# EAGLE design Ararinha4 (EAGLE 7.1.0)
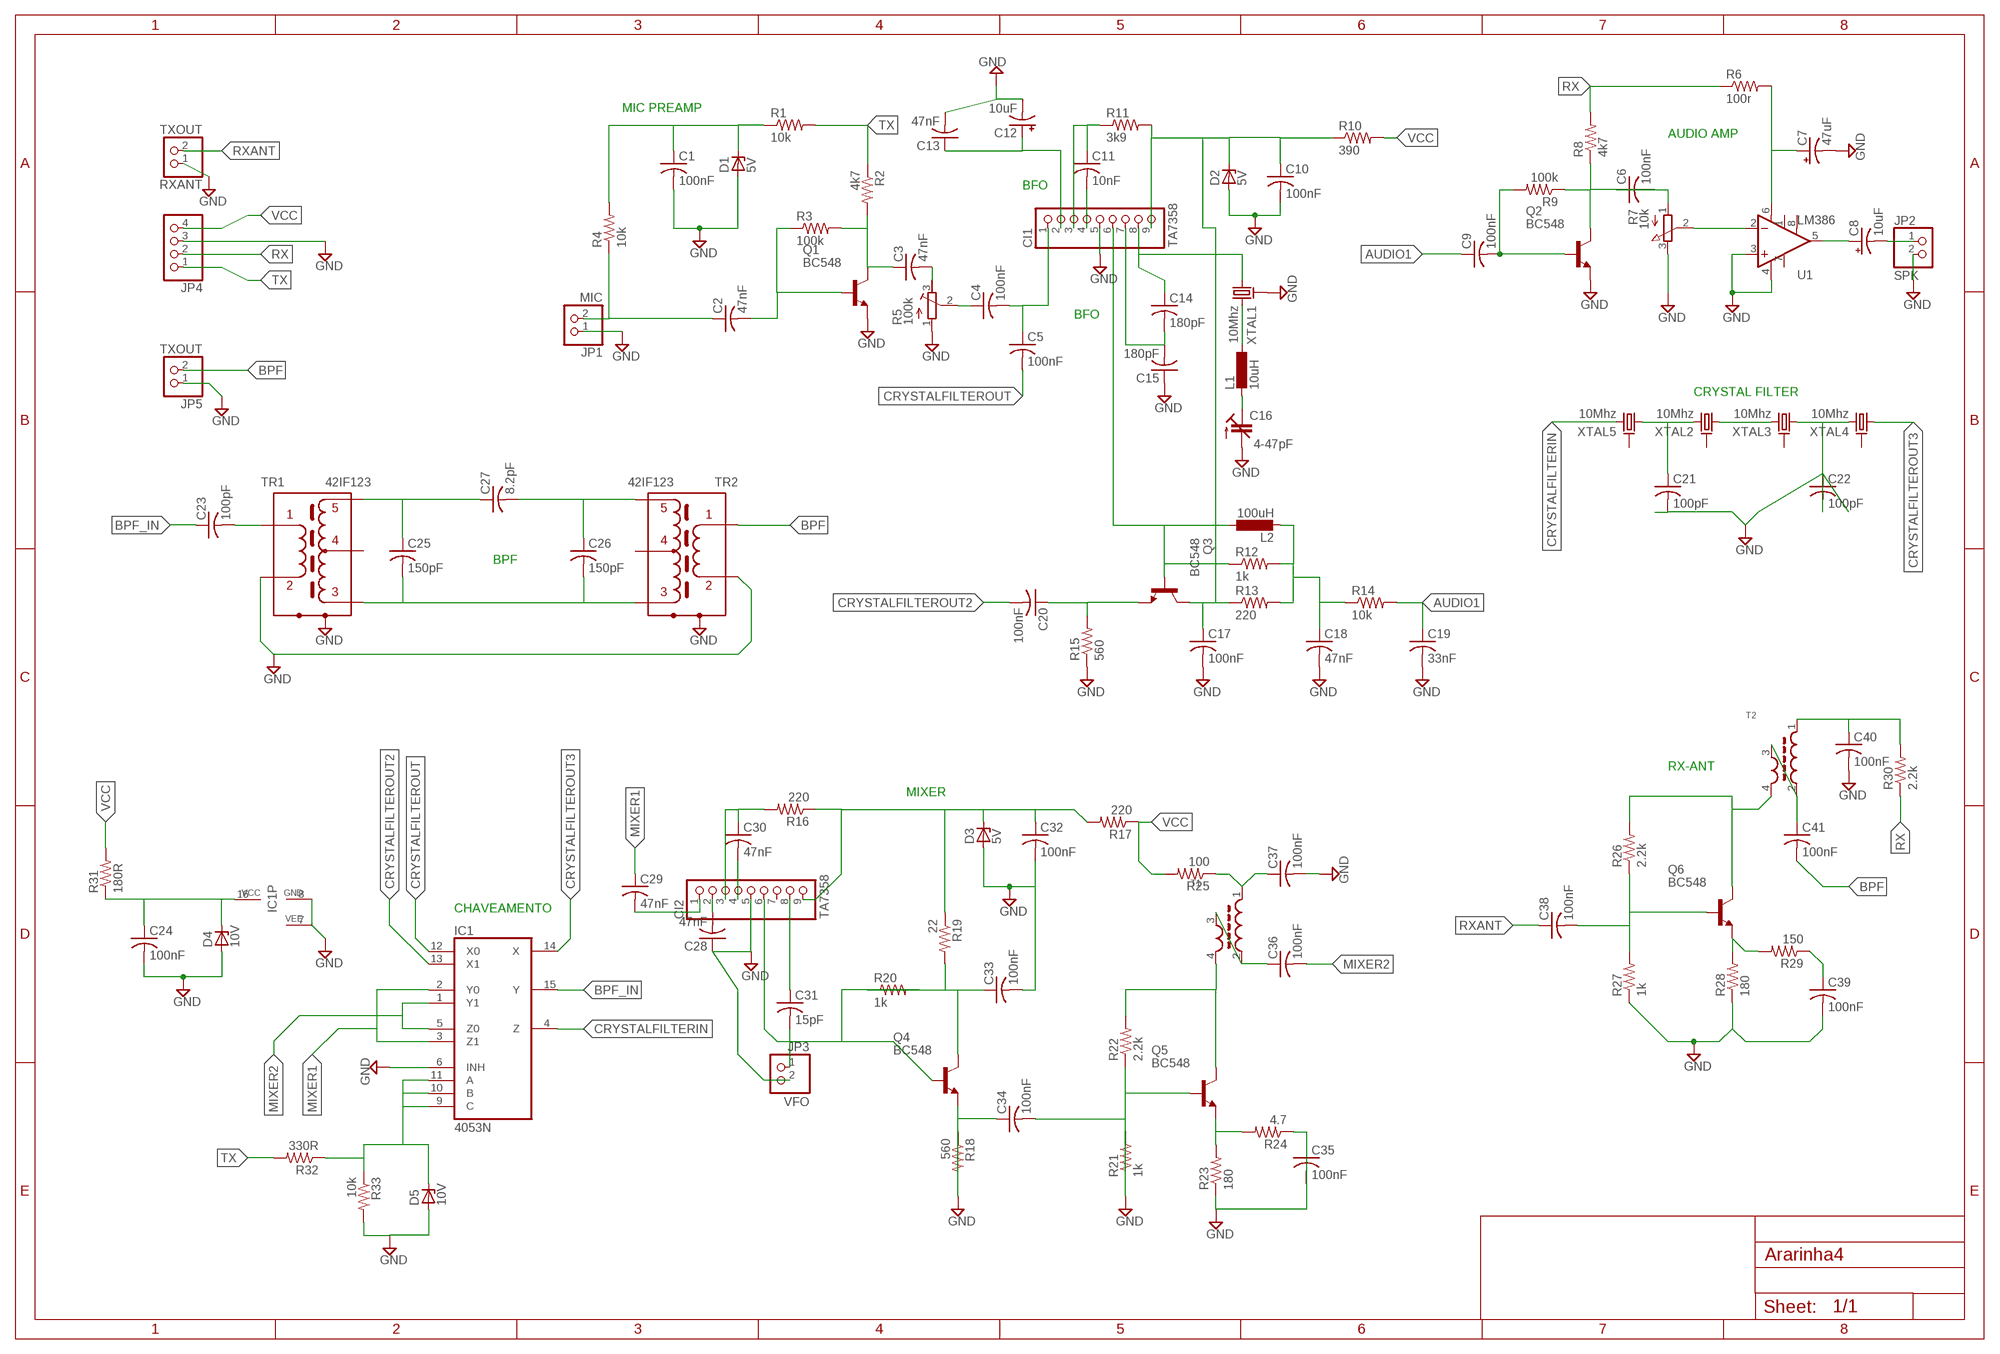
[diagram p0: schematic, sheet 1]

## Parts
C1  100nF  C-US050-030X075  [C050-030X075]
C2  47nF  C-US050-030X075  [C050-030X075]
C3  47nF  C-US050-030X075  [C050-030X075]
C4  100nF  C-US050-030X075  [C050-030X075]
C5  100nF  C-US050-030X075  [C050-030X075]
C6  100nF  C-US050-030X075  [C050-030X075]
C7  47uF  CPOL-USE5-6  [E5-6]
C8  10uF  CPOL-USE5-6  [E5-6]
C9  100nF  C-US050-030X075  [C050-030X075]
C10  100nF  C-US050-030X075  [C050-030X075]
C11  10nF  C-US050-030X075  [C050-030X075]
C12  10uF  CPOL-USE5-6  [E5-6]
C13  47nF  C-US050-030X075  [C050-030X075]
C14  180pF  C-US050-030X075  [C050-030X075]
C15  180pF  C-US050-030X075  [C050-030X075]
C16  4-47pF  C-TRIMM3050.504  [CTRIM3050.504]
C17  100nF  C-US050-030X075  [C050-030X075]
C18  47nF  C-US050-030X075  [C050-030X075]
C19  33nF  C-US050-030X075  [C050-030X075]
C20  100nF  C-US050-030X075  [C050-030X075]
C21  100pF  C-US050-030X075  [C050-030X075]
C22  100pF  C-US050-030X075  [C050-030X075]
C23  100pF  C-US050-030X075  [C050-030X075]
C24  100nF  C-US050-030X075  [C050-030X075]
C25  150pF  C-US050-030X075  [C050-030X075]
C26  150pF  C-US050-030X075  [C050-030X075]
C27  8.2pF  C-US050-030X075  [C050-030X075]
C28  47nF  C-US050-030X075  [C050-030X075]
C29  47nF  C-US050-030X075  [C050-030X075]
C30  47nF  C-US050-030X075  [C050-030X075]
C31  15pF  C-US050-030X075  [C050-030X075]
C32  100nF  C-US050-030X075  [C050-030X075]
C33  100nF  C-US050-030X075  [C050-030X075]
C34  100nF  C-US050-030X075  [C050-030X075]
C35  100nF  C-US050-030X075  [C050-030X075]
C36  100nF  C-US050-030X075  [C050-030X075]
C37  100nF  C-US050-030X075  [C050-030X075]
C38  100nF  C-US050-030X075  [C050-030X075]
C39  100nF  C-US050-030X075  [C050-030X075]
C40  100nF  C-US050-030X075  [C050-030X075]
C41  100nF  C-US050-030X075  [C050-030X075]
CI1  TA7358  PINHD-1X9  [1X09]
CI2  TA7358  PINHD-1X9  [1X09]
D1  5V  ZENER-DIODEZD-5  [ZDIO-5]
D2  5V  ZENER-DIODEZD-5  [ZDIO-5]
D3  5V  ZENER-DIODEZD-5  [ZDIO-5]
D4  10V  ZENER-DIODEZD-5  [ZDIO-5]
D5  10V  ZENER-DIODEZD-5  [ZDIO-5]
IC1  4053N  [DIL16]
JP1  MIC  PINHD-1X2  [1X02]
JP2  SPK  PINHD-1X2  [1X02]
JP3  VFO  PINHD-1X2  [1X02]
JP4  PINHD-1X4  [1X04]
JP5  TXOUT  PINHD-1X2  [1X02]
L1  10uH  L-EU0207/7  [0207/7]
L2  100uH  L-EU0207/7  [0207/7]
Q1  BC548  [TO92-EBC]
Q2  BC548  [TO92-EBC]
Q3  BC548  [TO92-EBC]
Q4  BC548  [TO92-EBC]
Q5  BC548  [TO92-EBC]
Q6  BC548  [TO92-EBC]
R1  10k  R-US_0204/7  [0204/7]
R2  4k7  R-US_0204/7  [0204/7]
R3  100k  R-US_0204/7  [0204/7]
R4  10k  R-US_0204/7  [0204/7]
R5  100k  R-TRIMM3299W  [RTRIM3299W]
R6  100r  R-US_0204/7  [0204/7]
R7  10k  3RP/1610N  [3RP/1610N]
R8  4k7  R-US_0204/7  [0204/7]
R9  100k  R-US_0204/7  [0204/7]
R10  390  R-US_0204/7  [0204/7]
R11  3k9  R-US_0204/7  [0204/7]
R12  1k  R-US_0204/7  [0204/7]
R13  220  R-US_0204/7  [0204/7]
R14  10k  R-US_0204/7  [0204/7]
R15  560  R-US_0204/7  [0204/7]
R16  220  R-US_0204/7  [0204/7]
R17  220  R-US_0204/7  [0204/7]
R18  560  R-US_0204/7  [0204/7]
R19  22  R-US_0204/7  [0204/7]
R20  1k  R-US_0204/7  [0204/7]
R21  1k  R-US_0204/7  [0204/7]
R22  2.2k  R-US_0204/7  [0204/7]
R23  180  R-US_0204/7  [0204/7]
R24  4.7  R-US_0204/7  [0204/7]
R25  100  R-US_0204/7  [0204/7]
R26  2.2k  R-US_0204/7  [0204/7]
R27  1k  R-US_0204/7  [0204/7]
R28  180  R-US_0204/7  [0204/7]
R29  150  R-US_0204/7  [0204/7]
R30  2.2k  R-US_0204/7  [0204/7]
R31  180R  R-US_0204/7  [0204/7]
R32  330R  R-US_0204/7  [0204/7]
R33  10k  R-US_0204/7  [0204/7]
RXANT  TXOUT  PINHD-1X2  [1X02]
T1  TOROID-T37-4PIN  [TOROID-T37-4PIN]
T2  TOROID-T37-4PIN  [TOROID-T37-4PIN]
TR1  42IF123  [42IF123]
TR2  42IF123  [42IF123]
U1  LM386  [DIP08]
XTAL1  10Mhz  CRISTAL_EM_PÉ  [CRISTAL_EM_PÉ]
XTAL2  10Mhz  CRISTAL_EM_PÉ  [CRISTAL_EM_PÉ]
XTAL3  10Mhz  CRISTAL_EM_PÉ  [CRISTAL_EM_PÉ]
XTAL4  10Mhz  CRISTAL_EM_PÉ  [CRISTAL_EM_PÉ]
XTAL5  10Mhz  CRISTAL_EM_PÉ  [CRISTAL_EM_PÉ]

## Nets
AUDIO1: C9.1 C19.1 R14.2
BPF: C41.2 JP5.2 TR2.P$1
BPF_IN: C23.1 IC1.15(Y)
CRYSTALFILTERIN: IC1.4(Z) XTAL5.1
CRYSTALFILTEROUT: C5.2 IC1.12(X0)
CRYSTALFILTEROUT2: C20.2 IC1.13(X1)
CRYSTALFILTEROUT3: IC1.14(X) XTAL4.2
GND: C1.2 C7.- C10.2 C12.- C13.2 C15.1 C16.2(A) C17.2 C18.2 C19.2 C21.2 C22.1 C24.2 C28.1 C32.2 C33.2 C35.1 C37.2 C39.2 C40.2 CI1.5 CI2.5 D1.A D2.A D3.A D4.A D5.A IC1.6(INH) IC1.7(VEE) IC1.8(GND) JP1.1 JP2.2 JP3.2 JP4.3 JP5.1 Q1.E Q2.E R5.1(E) R7.3(E) R15.1 R18.1 R21.2 R23.1 R27.1 R28.1 R33.2 RXANT.1 TR1.P$2 TR1.P$7 TR2.P$2 TR2.P$6 U1.3(+IN) U1.4(V-) XTAL1.GND
MIXER1: C29.1 IC1.2(Y0) IC1.3(Z1)
MIXER2: C36.2 IC1.1(Y1) IC1.5(Z0)
N$1: C1.1 D1.C R1.1 R4.2
N$2: C3.2 R5.3(A)
N$3: C4.1 R5.2(S)
N$4: C4.2 C5.1 CI1.1
N$5: C3.1 Q1.C R2.2 R3.2
N$6: C2.2 Q1.B R3.1
N$7: C2.1 JP1.2 R4.1
N$8: C9.2 Q2.B R9.2
N$9: C7.+ R6.2 U1.6(V+)
N$10: C6.1 R7.1(A)
N$11: C8.+ U1.5(OUT)
N$12: C8.- JP2.1
N$13: R7.2(S) U1.2(-IN)
N$14: C6.2 Q2.C R8.1 R9.1
N$15: C20.1 Q3.E R15.2
N$16: C11.2 CI1.4
N$17: C11.1 CI1.3 R11.1
N$18: L1.1 XTAL1.1
N$19: C12.+ C13.1 CI1.2
N$20: C16.1(E) L1.2
N$21: C14.2 C15.2 CI1.7
N$22: C14.1 CI1.8 XTAL1.2
N$23: CI1.6 L2.1 Q3.B R12.1
N$24: C10.1 C17.1 CI1.9 D2.C Q3.C R10.1 R11.2 R13.1
N$25: C21.1 XTAL2.1 XTAL5.2
N$26: C18.1 L2.2 R12.2 R13.2 R14.1
N$27: XTAL2.2 XTAL3.1
N$28: C22.2 XTAL3.2 XTAL4.1
N$29: C25.2 C26.2 TR1.P$3 TR2.P$3
N$30: C28.2 CI2.2
N$31: C23.2 TR1.P$1
N$32: D5.C IC1.9(C) IC1.10(B) IC1.11(A) R32.1 R33.1
N$33: C26.1 C27.2 TR2.P$5
N$34: C25.1 C27.1 TR1.P$5
N$35: C29.2 CI2.1
N$36: C30.2 CI2.4
N$37: C30.1 CI2.3 R16.2
N$38: C32.1 CI2.9 D3.C R16.1 R17.2 R19.1
N$39: C31.1 CI2.8
N$40: C31.2 JP3.1
N$41: C34.1 Q4.E R18.2
N$42: CI2.6 Q4.B R20.2
N$43: C35.2 R24.1
N$44: C33.1 Q4.C R19.2 R20.1
N$45: C36.1 T1.2 T1.3
N$46: C34.2 Q5.B R21.1 R22.1
N$47: Q5.C R22.2 T1.4
N$48: Q5.E R23.2 R24.2
N$49: C37.1 R25.1 T1.1
N$50: C38.2 Q6.B R26.1 R27.2
N$51: Q6.E R28.2 R29.2
N$52: C39.1 R29.1
N$53: C24.1 D4.C IC1.16(VCC) R31.1
N$54: Q6.C R26.2 T2.4
N$55: C41.1 T2.2 T2.3
N$56: C40.1 R30.2 T2.1
RX: JP4.2 R6.1 R8.2 R30.1
RXANT: C38.1 RXANT.2
TX: JP4.1 R1.2 R2.1 R32.2
VCC: JP4.4 R10.2 R17.1 R25.2 R31.2
Unconnected: CI2.7 TR1.P$4 TR1.P$6 TR2.P$4 TR2.P$7 U1.1(GAIN) U1.7(BP) U1.8(GAIN) XTAL2.GND XTAL3.GND XTAL4.GND XTAL5.GND

## Notes on the sheet
- MIC PREAMP
- AUDIO AMP
- BFO
- BFO
- CRYSTAL FILTER
- BPF
- RX-ANT
- MIXER
- CHAVEAMENTO

## Library data of the parts
C1-C6 C9-C11 C13-C15 C17-C41 = resistor:C-US: CAPACITOR, American symbol
C7 C8 C12 = resistor:CPOL-US: POLARIZED CAPACITOR, American symbol
C16 = resistor:C-TRIMM: Trimm capacitor
CI1 CI2 = pinhead:PINHD-1X9: PIN HEADER
D1-D5 = diode:ZENER-DIODE: Z-Diode
IC1 = 40xx:4053: Triple 2-channel ANALOG MULTIPLEXER
JP1-JP3 JP5 RXANT = pinhead:PINHD-1X2: PIN HEADER
JP4 = pinhead:PINHD-1X4: PIN HEADER
L1 L2 = resistor:L-EU: INDUCTOR, European symbol
Q1-Q6 = transistor-npn:BC548*: NPN Transistor
R1-R4 R6 R8-R33 = resistor:R-US_: RESISTOR, American symbol
R5 = resistor:R-TRIMM: Trimm resistor
R7 = pot:3RP/1610N: 16mm Potentiometer one level Source: http://www.alphapotentiometers.net/html/16mm_pot_2.html
T1 T2 = Toroid_T37:TOROID-T37-4PIN: Toroidal trafo of size T37 (9.53 x 5.21 x 3.25). Outward shape corresponds to one layer winding with wire of diameter 0.4mm.
TR1 TR2 = 42IF123:42IF123: IF transformer 10.7 MHz
U1 = Sparkfun-Eagle-Libraries:LM386: low voltage audio power amplifier
XTAL1-XTAL5 = Controle_de_pedais:CRISTAL_EM_PÉ

## Board
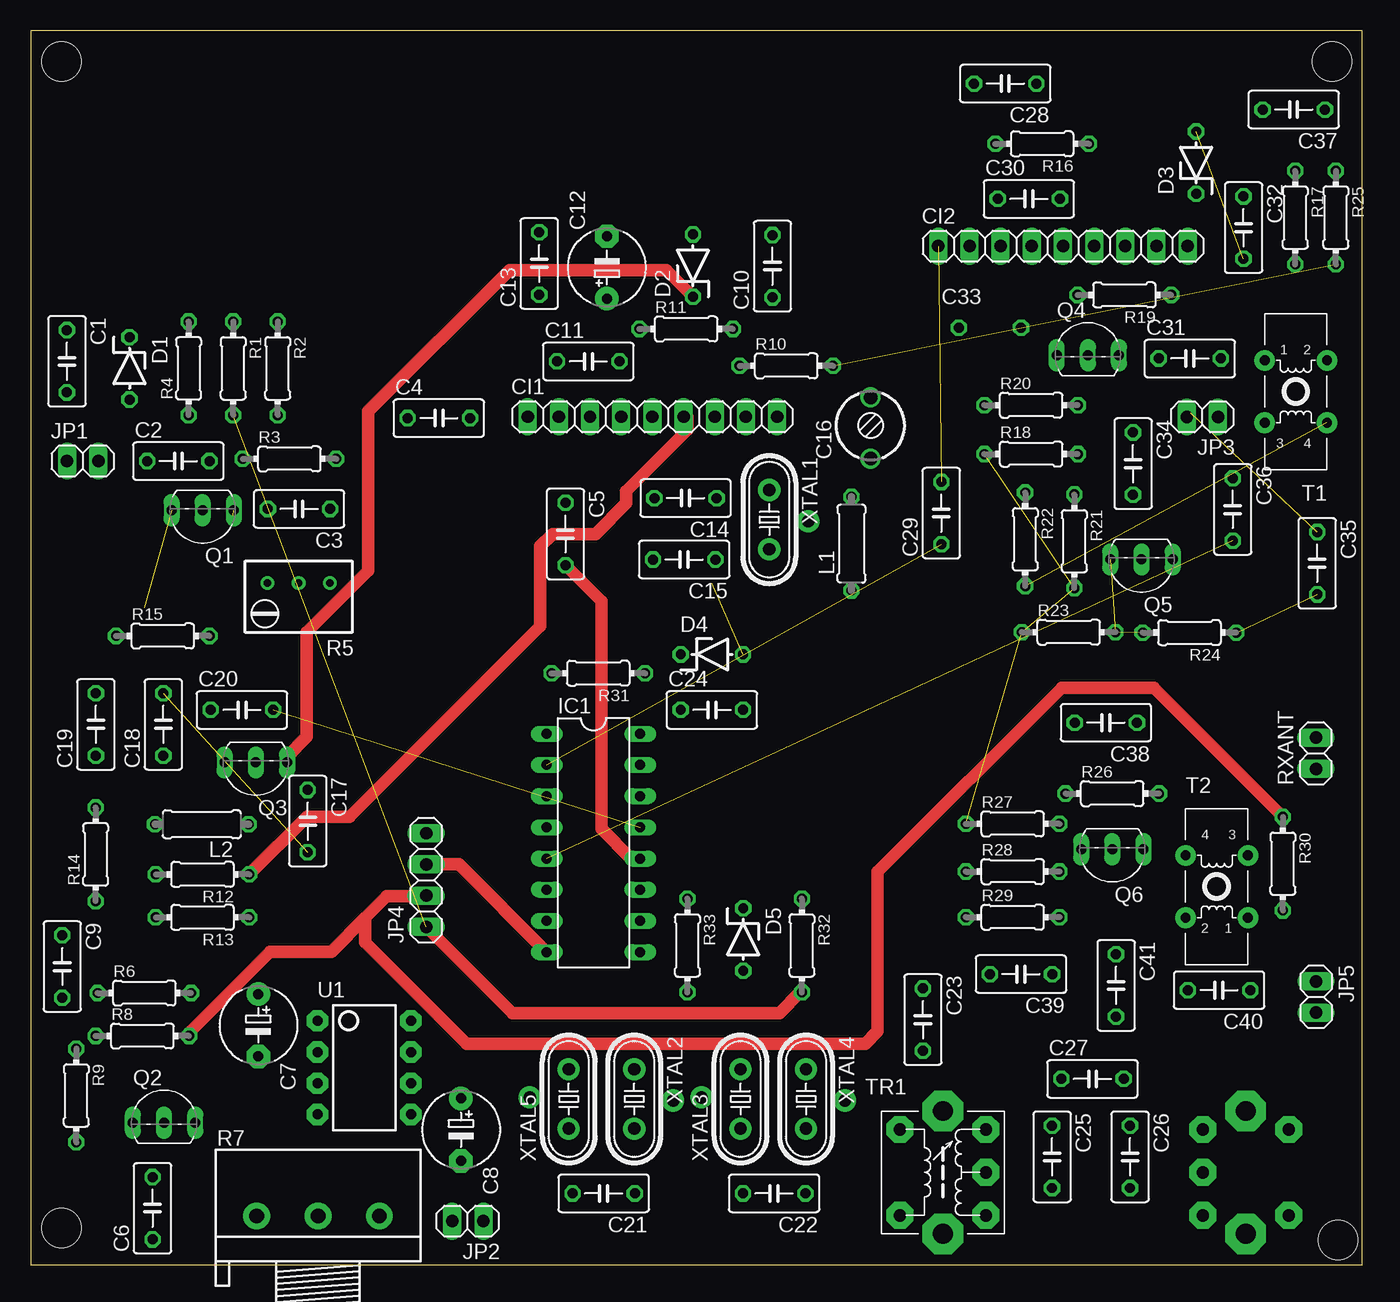
[diagram p1: board, top side]
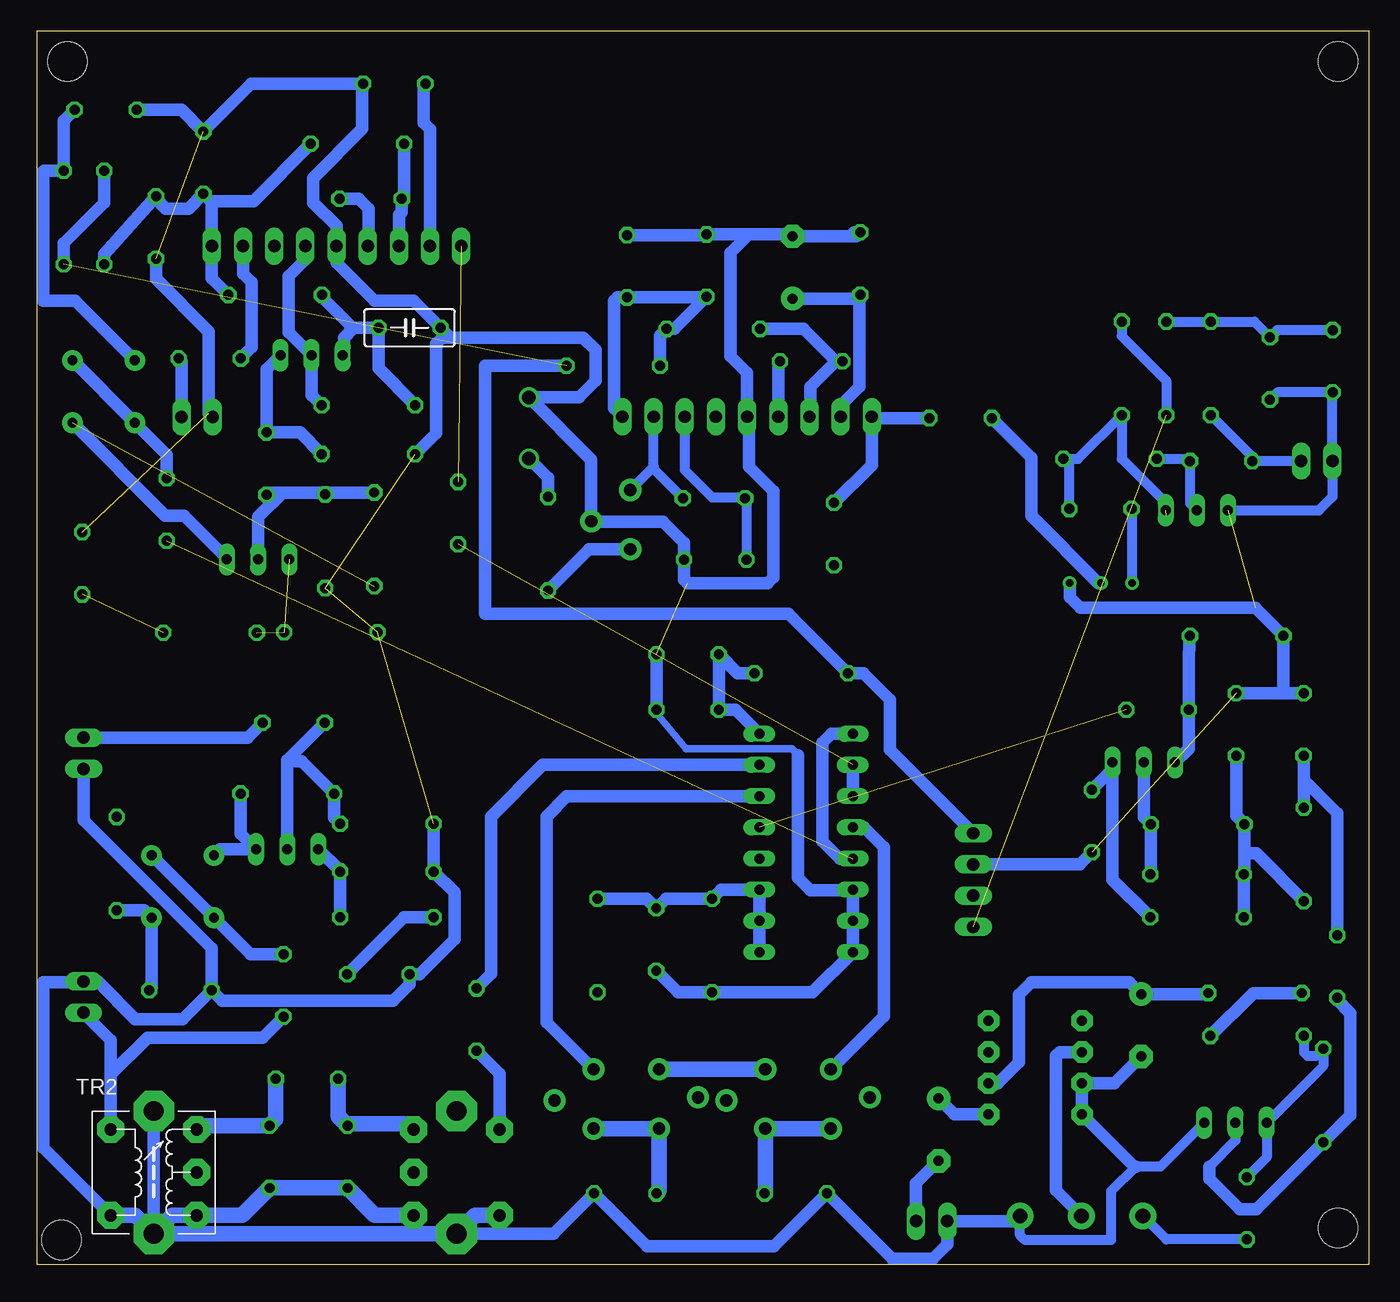
[diagram p2: board, bottom side, seen from below]

Size 108.5 x 100.5 mm. Coordinates in mm from the lower left corner, seen from the top.
Outline: 0,0 108.5,0 108.5,100.5 0,100.5 0,0
Copper layers (1*16): Top 0.035mm / dielectric 1.5mm / Bottom 0.035mm
Design rules "default": minimum track width 10mil, minimum drill 24mil, track to track 8mil, track to pad 8mil, pad to pad 8mil, via to via 8mil, smd to smd 8mil, copper to edge 40mil, drill to drill 8mil, minimum pad ring 10mil, minimum via ring 8mil, stop-mask expansion 4mil, vias tented up to drill 0mil, thermal gap 10mil
Holes 3.2 mm at 2.5,3 106.5,2 106,98 2.5,98

### Footprints (pad centres in the part's own frame; a part is rotated, then mirrored left to right if it is on the bottom)
C050-030X075 = drill 0.813 octagon: 1 -2.54,0; 2 2.54,0
E5-6 = drill 0.813 pad 1.905: + -2.54,0 | drill 0.813 pad 1.905 octagon: - 2.54,0
CTRIM3050.504 = drill 1.1: 1 -2.5,0; 2 2.5,0
1X09 = drill 1.016 long: 1 -10.16,0; 2 -7.62,0; 3 -5.08,0; 4 -2.54,0; 5 0,0; 6 2.54,0; 7 5.08,0; 8 7.62,0; 9 10.16,0
ZDIO-5 = drill 0.813 octagon: A 2.54,0; C -2.54,0
DIL16 = drill 0.813 long: 1 -8.89,-3.81; 2 -6.35,-3.81; 3 -3.81,-3.81; 4 -1.27,-3.81; 5 1.27,-3.81; 6 3.81,-3.81; 7 6.35,-3.81; 8 8.89,-3.81; 9 8.89,3.81; 10 6.35,3.81; 11 3.81,3.81; 12 1.27,3.81; 13 -1.27,3.81; 14 -3.81,3.81; 15 -6.35,3.81; 16 -8.89,3.81
1X02 = drill 1.016 long: 1 -1.27,0; 2 1.27,0
1X04 = drill 1.016 long: 1 -3.81,0; 2 -1.27,0; 3 1.27,0; 4 3.81,0
0207/7 = drill 0.813 octagon: 1 -3.81,0; 2 3.81,0
TO92-EBC = drill 0.813 long: B 0,-1.27; C -2.54,-1.27; E 2.54,-1.27
0204/7 = drill 0.813 octagon: 1 -3.81,0; 2 3.81,0
RTRIM3299W = drill 0.61: 1 1.27,-2.54; 2 1.27,0; 3 1.27,2.54
3RP/1610N = drill 1.2 pad 2.184: 1 -5,0; 2 0,0; 3 5,0
TOROID-T37-4PIN = drill 0.8 pad 1.676: 1 2.54,2.54; 2 2.54,-2.54; 3 -2.54,2.54; 4 -2.54,-2.54
42IF123 = drill 1 pad 2.184 octagon: P$1 -3.5,3.5; P$2 -3.5,-3.5; P$3 3.5,-3.5; P$4 3.5,0; P$5 3.5,3.5 | drill 1.6 pad 3.302 octagon: P$6 0,5; P$7 0,-5
DIP08 = drill 0.813 pad 1.727 octagon: 1 -3.81,-3.81; 2 -1.27,-3.81; 3 1.27,-3.81; 4 3.81,-3.81; 5 3.81,3.81; 6 1.27,3.81; 7 -1.27,3.81; 8 -3.81,3.81
CRISTAL_EM_PÉ = drill 1 pad 1.8: 1 2.413,0; 2 -2.413,0; GND 0.127,3.175

### Placement (x,y rotation side)
C1  2.95,73.58 270 top
C2  12.03,65.45 0 top
C3  21.86,61.55 180 top
C4  33.25,68.95 0 top
C5  43.57,59.51 270 top
C6  9.93,4.6 90 top
C7  18.55,19.5 270 top
C8  35.05,11 270 top
C9  2.57,24.29 270 top
C10  60.43,81.32 90 top
C11  45.43,73.57 0 top
C12  46.95,81.22 90 top
C13  41.43,81.54 90 top
C14  53.35,62.43 180 top
C15  53.24,57.43 180 top
C16  68.42,68.14 90 top
C17  22.57,36.13 270 top
C18  10.81,44 90 top
C19  5.31,44 90 top
C20  17.21,45.19 0 top
C21  46.68,5.81 180 top
C22  60.57,5.81 180 top
C23  72.69,19.96 270 top
C24  55.5,45.19 0 top
C25  83.21,8.79 270 top
C26  89.56,8.79 270 top
C27  86.5,15.14 0 top
C28  79.4,96.19 180 top
C29  74.19,61.21 90 top
C30  81.32,86.81 0 top
C31  94.43,73.81 0 top
C32  98.81,84.46 270 top
C33  78.15,76.31 0 bottom
C34  89.81,65.24 270 top
C35  104.81,57.13 270 top
C36  97.93,61.51 270 top
C37  102.9,94.07 180 top
C38  87.6,44.14 180 top
C39  80.68,23.66 180 top
C40  96.82,22.36 180 top
C41  88.43,22.75 270 top
CI1  50.65,69.06 0 top
CI2  84.1,82.95 0 top
D1  8.05,73 270 top
D2  53.95,81.37 90 top
D3  94.95,89.75 90 top
D4  55.5,49.7 0 top
D5  58.05,26.49 270 top
IC1  45.85,34.35 270 top
JP1  4.24,65.45 0 top
JP2  35.61,3.55 180 top
JP3  95.46,69.05 180 top
JP4  32.22,31.33 90 top
JP5  104.73,21.8 270 top
L1  66.87,58.72 90 top
L2  13.94,35.87 180 top
Q1  14.01,60.17 180 top
Q2  10.87,12.83 0 top
Q3  18.34,39.64 180 top
Q4  86.13,75.33 0 top
Q5  90.49,56.17 180 top
Q6  88.12,32.57 180 top
R1  16.5,73 270 top
R2  20.13,73 270 top
R3  21.08,65.63 0 top
R4  12.87,73 90 top
R5  21.83,54.25 90 top
R6  9.26,22.13 0 top
R7  23.41,3.97 0 top
R8  9.1,18.63 0 top
R9  3.71,13.78 270 top
R10  61.56,73.21 0 top
R11  53.4,76.21 0 top
R12  14,31.79 180 top
R13  14,28.29 180 top
R14  5.29,33.42 90 top
R15  10.76,51.21 0 top
R16  82.4,91.29 180 top
R17  103.02,85.28 270 top
R18  81.5,66.02 0 top
R19  89.1,78.98 180 top
R20  81.5,70 0 top
R21  85.02,58.92 270 top
R22  81.02,59.08 270 top
R23  84.56,51.52 0 top
R24  94.4,51.48 180 top
R25  106.33,85.28 270 top
R26  88.11,38.37 0 top
R27  80,35.91 0 top
R28  80,32.02 0 top
R29  80,28.3 0 top
R30  102.02,32.66 270 top
R31  46.24,48.17 180 top
R32  62.83,26 270 top
R33  53.5,26 270 top
RXANT  104.7,41.65 90 top
T1  103.07,71.11 90 top
T2  96.62,30.8 270 top
TR1  74.32,7.52 0 top
TR2  98.99,7.52 0 bottom
U1  27.17,16.05 270 top
XTAL1  60.17,60.68 270 top
XTAL2  49.17,13.5 270 top
XTAL3  57.83,13.5 90 top
XTAL4  63.17,13.5 270 top
XTAL5  43.83,13.5 90 top

### Tracks (layer width: path | path; a pad name or v marks a point on that pad's centre or on a via)
AUDIO1
  Bottom 1.016: C19.1 5.29,41.44 5.29,39.5 | 5.29,39.5 R14.2 | C9.1 2.57,36.78 5.29,39.5
BPF
  Bottom 1.016: TR2.P$1 102.49,15 102.49,15.51 | 102.49,15.51 99.5,18.5 90.13,18.5 C41.2 | JP5.2 102.49,18.3 102.49,15.51
BPF_IN
  Bottom 1.016: C23.1 71.5,23.69 71.5,36.5 67.3,40.7 IC1.15
CRYSTALFILTERIN
  Bottom 1.016: IC1.4 41.12,35.62 39.5,34 39.5,20.24 XTAL5.1
CRYSTALFILTEROUT
  Top 1.016: C5.2 46.5,54.04 46.5,35.5 48.92,33.08 IC1.12
CRYSTALFILTEROUT2  (1 unrouted)
CRYSTALFILTEROUT3
  Bottom 1.016: IC1.14 65.34,38.16 67,36.5 67,19.74 XTAL4.2
GND  (8 unrouted)
  Top 1.016: JP4.3 34.9,32.6 IC1.8
  Bottom 0.61: 46.5,41.5 47.01,42.01 55.63,42.01 58.04,44.92 C24.2
  Bottom 0.813: Q2.E 16.97,8 19,8 21,6 21,2 28,2 28.41,2.41 R7.3 | D1.A 7.47,71.04 C1.2 2.97,71.02 JP1.1 2.97,62.53 4.06,61.44 Q1.E
  Bottom 1.016: D5.A 56.29,22.19 R33.2 45.31,22.19 IC1.8 IC1.7 IC1.6 42.08,30.5 45.5,30.5 46.5,31.5 46.5,41.5 | C24.2 D4.A | R27.1 R28.1 74.5,30.33 74.5,26.5 77.34,23.66 C39.2 78.14,22.86 79.5,21.5 93.42,21.5 C40.2 | C19.2 C18.2 6.95,46.54 R15.1 9.24,53.5 23.5,53.5 24.37,54.37 R5.1 | R7.3 28.83,3.55 JP2.2 34.34,1.66 35.5,0.5 38.83,0.5 C21.2 48.45,1.5 58.8,1.5 C22.1 66.4,2.52 TR1.P$7 | C7.- 20.73,14.78 U1.3 U1.4 19.12,8 19,8 | TR2.P$6 99,12.5 99,2.5 | C40.2 94.28,25.78 104.7,36.2 RXANT.1 | TR2.P$2 108,9.53 108,23 104.8,23 JP5.1 103.57,23.07 100.5,20 96.63,20 C40.2 | C17.2 23.56,32.6 JP4.3 | 42,84 41.92,84.08 C13.2 41.75,83.76 C12.- 47.1,83.91 50.5,83.91 | C10.2 54,83.86 D2.A 50.5,83.91 | 50.5,83.91 52,82.41 52,74 50.65,72.65 CI1.5 50.5,68.91 50.5,65 48.5,63 48.5,56 49,55.5 55.5,55.5 55.78,55.78 C15.1 55.78,58.78 57.5,60.5 63.29,60.5 XTAL1.GND 63.34,65.56 C16.2 64.36,70.64 63,72 63,74.5 64,75.5 74.8,75.5 | JP3.2 94.5,69.36 94.5,76 98.81,80.31 C32.2 | 74.8,75.5 C33.2 77.8,78.5 81,78.5 84.1,81.6 CI2.5 84.1,84.6 86,86.5 86,88.5 82,92.5 82,96.13 C28.1 91.05,96.19 D3.A 96.73,94.07 C37.2 | 74.8,75.5 75.5,75.5 76,75 76,67.71 R18.1
  Bottom 1.27: TR2.P$2 100.52,4.02 99,2.5 98.98,2.52 TR1.P$7 72.82,4.02 TR1.P$2
MIXER1  (1 unrouted)
  Bottom 1.016: IC1.2 IC1.3
MIXER2  (1 unrouted)
  Bottom 1.016: IC1.1 43.76,43.24 44.5,42.5 44.5,34.5 43.08,33.08 IC1.5
N$1
  Bottom 0.813: R1.1 R4.2 9.32,76.81 D1.C 7.47,76.12 C1.1
N$2
  Bottom 0.813: C3.2 19.32,55.55 R5.3
N$3
  Bottom 1.016: R5.2 22.02,55.52 27.5,61 27.5,65.74 C4.1
N$4
  Bottom 1.016: C4.2 40.38,68.95 CI1.1 40.49,65.13 C5.1
N$5  (1 unrouted)
  Bottom 0.813: C3.1 24.4,65.14 R3.2 23.69,65.63 R2.2 20.13,65.63 16.5,62 16.5,61
N$6
  Bottom 0.813: Q1.B 14.57,62 C2.2 14.75,65.63 R3.1
N$7
  Bottom 0.813: JP1.2 C2.1 9.49,65.81 R4.1
N$8
  Bottom 0.813: Q2.B 10.87,10.13 13,8
  Bottom 1.016: 13,8 13,7 10.5,4.5 9.18,4.5 R9.2 1.5,12.18 1.5,20.5 2.57,21.57 C9.2
N$9
  Bottom 1.016: U1.6 30.22,14.78 28.5,16.5 28.5,22 27.5,23 19.51,23 C7.+ 13.16,22.04 R6.2
N$10
  Bottom 0.813: C6.1 16.5,2.06 R7.1
N$11
  Bottom 1.016: C8.+ 33.75,12.24 U1.5
N$12
  Bottom 1.016: C8.- 36.88,6.63 JP2.1
N$13
  Bottom 1.016: R7.2 25.5,6.06 25.5,17 25.18,17.32 U1.2
N$14
  Bottom 0.813: C6.2 8.33,8.74 Q2.C 3.71,16.18 R9.1 4.3,17 5,17 5.29,17.29 R8.1
N$15
  Bottom 1.016: R15.2 14.67,49.55 C20.1 14.67,42.03 Q3.E
N$16
  Bottom 1.016: CI1.4 48.11,73.43 C11.2
N$17
  Bottom 1.016: C11.1 43.43,73.57 | 43.43,73.57 45.5,71.5 45.5,69.13 CI1.3 | R11.1 46.07,76.21 43.43,73.57
N$18
  Bottom 1.016: L1.1 63.51,58.27 XTAL1.1
N$19
  Bottom 1.016: CI1.2 43.03,69.97 41.5,71.5 41.5,78.93 C13.1 41.43,78.68 C12.+
N$20
  Bottom 1.016: L1.2 66.87,64.09 C16.1
N$21
  Bottom 0.813: C15.2 50.7,62.32 C14.2 50.88,62.5 53.5,62.5 55.73,64.73 CI1.7
N$22
  Bottom 0.813: XTAL1.2 58.27,64.99 | 58.27,64.99 CI1.8 | C14.1 58.27,64.81 58.27,64.99
N$23
  Top 1.016: R12.1 22.52,36.5 26,36.5 41.5,52 41.5,58.5 42.5,59.5 46,59.5 48.5,62 48.5,63 53.5,68 53.5,69 53.25,69 CI1.6
  Bottom 1.016: Q3.B 18.34,36.46 L2.1 17.75,31.85 R12.1
N$24
  Top 1.016: D2.C 51.78,81 39,81 27.5,69.5 27.5,56.5 22.5,51.5 22.5,43 20.88,41.38 Q3.C
  Bottom 1.016: CI1.9 61.5,69.75 61.5,78.5 61.22,78.78 C10.1 54,78.78 D2.C 56.57,76.21 R11.2 57.75,75.67 R10.1 | R13.1 20.88,31.36 Q3.C 20.88,40.36 C17.1
N$25
  Bottom 1.27: XTAL5.2 XTAL2.1 49.17,5.86 C21.1
N$26
  Bottom 1.016: 10.13,33.5 L2.2 10.81,36.55 C18.1 | 10.13,33.5 10.13,31.79 R12.2 R13.2 | R14.1 9.18,33.5 10.13,33.5
N$27
  Bottom 1.27: XTAL2.2 XTAL3.1
N$28
  Bottom 1.27: XTAL4.1 XTAL3.2 57.83,6.01 C22.2
N$29
  Bottom 1.27: 99,2.5 97.48,4.02 TR2.P$3 91.79,4.02 C26.2 C25.2 80.98,4.02 TR1.P$3
N$30
  Bottom 1.016: CI2.2 76.48,92.48 77,93 77,96.05 C28.2
N$31
  Bottom 1.016: TR1.P$1 70.82,15.55 C23.2
N$32
  Bottom 1.016: IC1.9 IC1.10 IC1.11 52.77,30.54 R33.1 57.27,29.81 D5.C 58.83,29.81 R32.1
N$33
  Bottom 1.27: C27.2 89.04,11.85 C26.1 95.18,11.33 TR2.P$5
N$34
  Bottom 1.27: TR1.P$5 78.3,11.5 83.04,11.5 arc-90 C25.1 83.96,12.08 C27.1
N$35  (1 unrouted)
N$36
  Bottom 1.016: C30.2 82.31,86.81 81.5,86 81.5,83.01 CI2.4
N$37
  Bottom 1.016: R16.2 78.59,87 C30.1 78.78,85.72 79,85.5 79,82.97 CI2.3
N$38
  Bottom 1.016: 94.37,86.63 D3.C 96.16,86 98,86 98.81,86.81 C32.1 103.02,82.29 R17.2 | 94.37,86.63 94.26,86.52 CI2.9 94.26,80.33 R19.1 | R16.1 90.87,86.63 94.37,86.63
N$39
  Bottom 1.016: C31.1 91,74.7 91,80 91.72,80.72 CI2.8
N$40
  Bottom 1.016: C31.2 96.73,73.57 JP3.1
N$41
  Bottom 1.016: R18.2 87.07,67.78 C34.1 89.81,72.92 Q4.E
N$42
  Bottom 1.016: CI2.6 86.64,81.86 88,80.5 88,75.93 Q4.B 86.13,70.82 R20.2
N$43  (1 unrouted)
N$44
  Bottom 1.016: 82.75,76.25 82.69,76.31 C33.1 80.69,73 R20.1 | 82.75,76.25 83.5,75.5 83.5,74.15 Q4.C | R19.2 85.29,78.79 82.75,76.25
N$45
  Bottom 1.016: T1.2 T1.3 97.93,65.97 C36.1
N$46
  Bottom 1.016: R21.1 84.86,62.89 R22.1 88.5,62.89 | 88.5,62.89 89.62,62.89 C34.2 | Q5.B 90.49,60.9 88.5,62.89
N$47  (1 unrouted)
  Bottom 1.016: Q5.C 93.03,57.53 96.5,61 98.04,61 T1.4
N$48  (2 unrouted)
N$49
  Bottom 1.016: C37.1 106.33,93.18 R25.1 107.91,89.09 108,89 108,78.5 105.38,78.5 T1.1
N$50
  Bottom 1.016: C38.2 88.12,41.08 88.12,41 | 88.12,41 Q6.B | R27.2 84.3,36.4 R26.1 86.93,41 88.12,41
N$51
  Bottom 1.016: Q6.E 83.81,32.07 R28.2 R29.2
N$52
  Bottom 1.016: R29.1 78.58,28.3 C39.1
N$53
  Bottom 1.016: 52.93,49.67 D4.C | D4.C C24.1 51.61,45.19 IC1.16 | R31.1 51.43,48.17 D4.C
N$54
  Bottom 1.016: T2.4 93.59,33.84 Q6.C 91.92,35.1 R26.2
N$55
  Bottom 1.016: T2.3 T2.2 91.11,25.29 C41.1
N$56
  Bottom 1.016: R30.2 99.75,28.85 T2.1 99.16,22.55 C40.1
RX
  Top 1.016: R8.2 12.91,18.91 19.5,25.5 24.5,25.5 27.25,28.25 | 27.25,28.25 29,30 32.16,30 JP4.2 | R30.1 91.48,47 84,47 69,32 69,19 68,18 35.5,18 27.25,26.25 27.25,28.25
  Bottom 1.016: R6.1 9.41,22.13 R8.2
RXANT
  Bottom 1.016: C38.1 91.36,42.92 RXANT.2
TX  (1 unrouted)
  Top 1.016: R32.2 62.69,22.19 61,20.5 39.24,20.5 JP4.1
  Bottom 0.813: R2.1 20.13,75.63 16.5,72 R1.2
VCC  (1 unrouted)
  Bottom 1.016: JP4.4 39,41.92 39,46 41.17,48.17 R31.2 47.26,53 72,53 72,73.21 R10.2 | R17.1 103.02,86.48 106.33,83.17 R25.2